# EAGLE design 32 zif to omnetics (EAGLE 7.2.0)
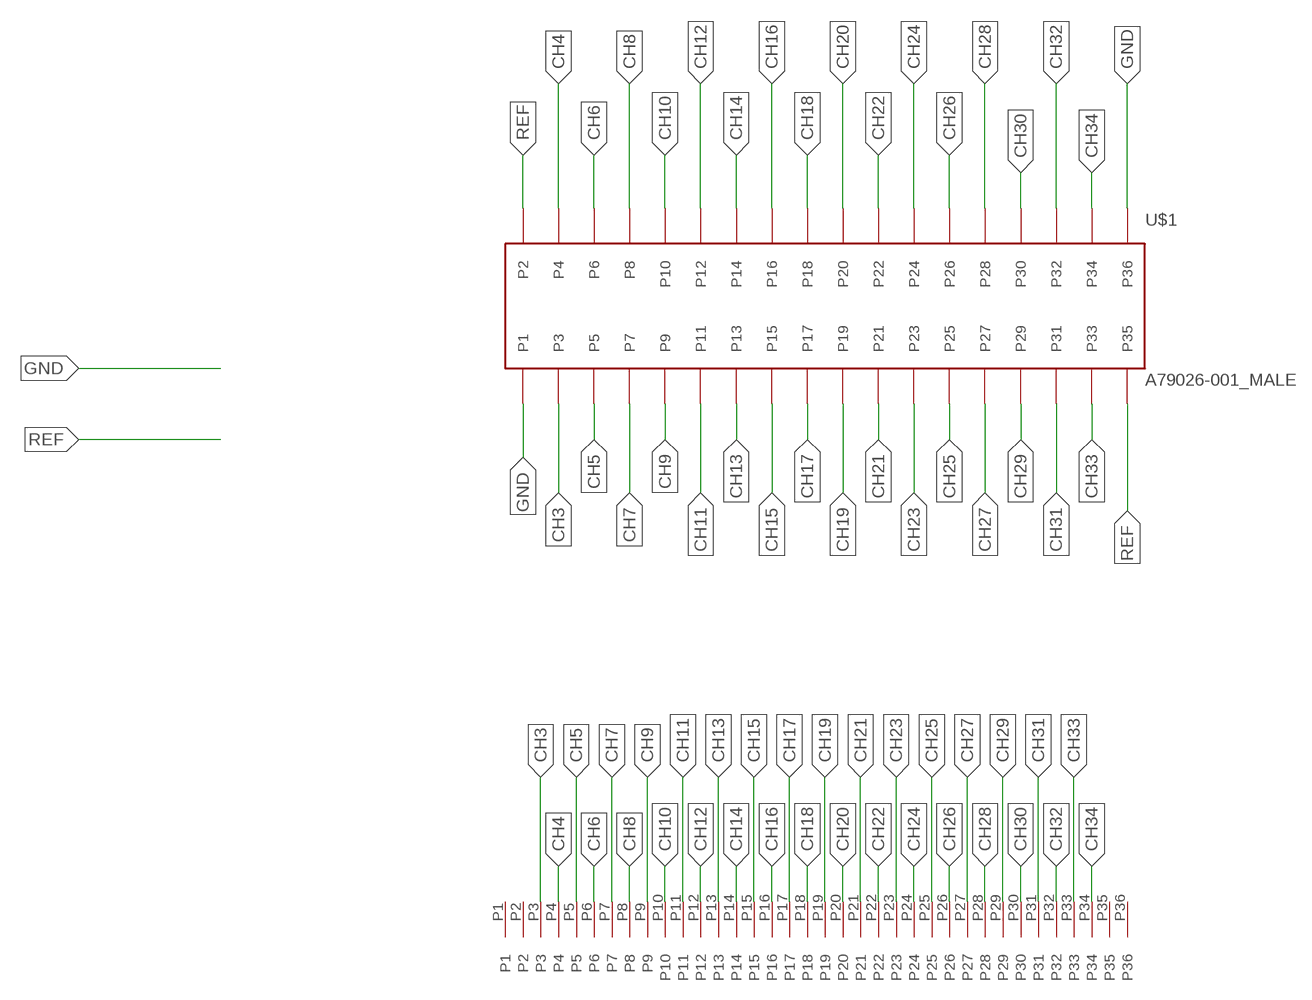
[diagram p0: schematic, sheet 1]

## Parts
U$1  A79026-001_MALE  [A79026-001_MALE]
U$2  ZIF_CONNECTOR_36  [ZIF_CONNECTOR_36]

## Nets
CH3: U$1.P3 U$2.P3
CH4: U$1.P4 U$2.P4
CH5: U$1.P5 U$2.P5
CH6: U$1.P6 U$2.P6
CH7: U$1.P7 U$2.P7
CH8: U$1.P8 U$2.P8
CH9: U$1.P9 U$2.P9
CH10: U$1.P10 U$2.P10
CH11: U$1.P11 U$2.P11
CH12: U$1.P12 U$2.P12
CH13: U$1.P13 U$2.P13
CH14: U$1.P14 U$2.P14
CH15: U$1.P15 U$2.P15
CH16: U$1.P16 U$2.P16
CH17: U$1.P17 U$2.P17
CH18: U$1.P18 U$2.P18
CH19: U$1.P19 U$2.P19
CH20: U$1.P20 U$2.P20
CH21: U$1.P21 U$2.P21
CH22: U$1.P22 U$2.P22
CH23: U$1.P23 U$2.P23
CH24: U$1.P24 U$2.P24
CH25: U$1.P25 U$2.P25
CH26: U$1.P26 U$2.P26
CH27: U$1.P27 U$2.P27
CH28: U$1.P28 U$2.P28
CH29: U$1.P29 U$2.P29
CH30: U$1.P30 U$2.P30
CH31: U$1.P31 U$2.P31
CH32: U$1.P32 U$2.P32
CH33: U$1.P33 U$2.P33
CH34: U$1.P34 U$2.P34
GND: U$1.P1 U$1.P36
REF: U$1.P2 U$1.P35
Unconnected: U$2.P1 U$2.P2 U$2.P35 U$2.P36

## Library data of the parts
U$1 = omnetics:A79026-001_MALE
U$2 = mayo_parts:ZIF_CONNECTOR_36

## Board
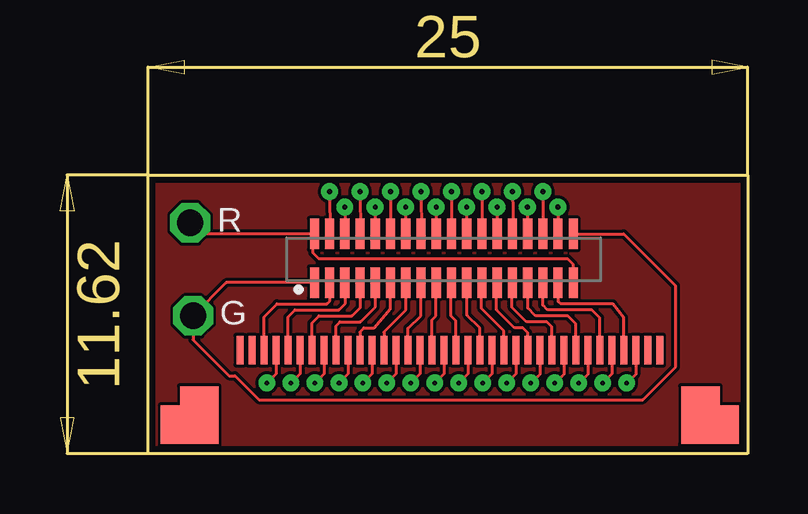
[diagram p1: board, top side]
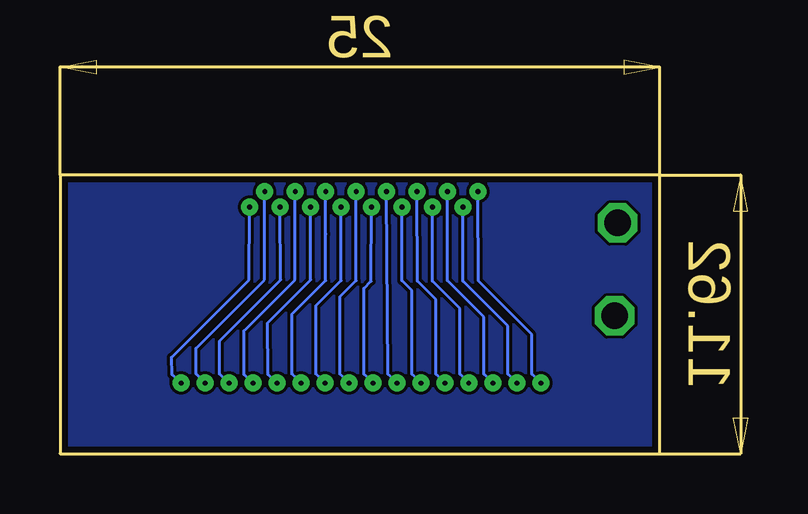
[diagram p2: board, bottom side, seen from below]

Size 25 x 11.62 mm. Coordinates in mm from the lower left corner, seen from the top.
Outline: 0,0 0,11.62 25,11.62 25,0 0,0
Copper layers (1*16): Top 0.035mm / dielectric 1.5mm / Bottom 0.035mm
Design rules "pcbtrain *": minimum track width 0.125mm, minimum drill 0.2mm, track to track 0.125mm, track to pad 0.125mm, pad to pad 0.125mm, via to via 0.125mm, smd to smd 0mil, copper to edge 10mil, drill to drill 0.2mm, minimum pad ring 10mil, minimum via ring 10mil, stop-mask expansion 0.125mm, vias tented up to drill 0mil, thermal gap 10mil

### Footprints (pad centres in the part's own frame; a part is rotated, then mirrored left to right if it is on the bottom)
A79026-001_MALE = smd 0.381 x 1.27: P1 -5.397,-1.016; P2 -5.397,1.016; P3 -4.763,-1.016; P4 -4.763,1.016; P5 -4.128,-1.016; P6 -4.128,1.016; P7 -3.493,-1.016; P8 -3.493,1.016; P9 -2.857,-1.016; P10 -2.857,1.016; P11 -2.223,-1.016; P12 -2.223,1.016; P13 -1.587,-1.016; P14 -1.587,1.016; P15 -0.953,-1.016; P16 -0.953,1.016; P17 -0.318,-1.016; P18 -0.318,1.016; P19 0.318,-1.016; P20 0.318,1.016; P21 0.953,-1.016; P22 0.953,1.016; P23 1.587,-1.016; P24 1.587,1.016; P25 2.223,-1.016; P26 2.223,1.016; P27 2.857,-1.016; P28 2.857,1.016; P29 3.493,-1.016; P30 3.493,1.016; P31 4.128,-1.016; P32 4.128,1.016; P33 4.763,-1.016; P34 4.763,1.016; P35 5.397,-1.016; P36 5.397,1.016
ZIF_CONNECTOR_36 = smd 0.3 x 1.2: P1 -8.5,0; P2 -8,0; P3 -7.5,0; P4 -7,0; P5 -6.5,0; P6 -6,0; P7 -5.5,0; P8 -5,0; P9 -4.5,0; P10 -4,0; P11 -3.5,0; P12 -3,0; P13 -2.5,0; P14 -2,0; P15 -1.5,0; P16 -1,0; P17 -0.5,0; P18 0,0; P19 0.5,0; P20 1,0; P21 1.5,0; P22 2,0; P23 2.5,0; P24 3,0; P25 3.5,0; P26 4,0; P27 4.5,0; P28 5,0; P29 5.5,0; P30 6,0; P31 6.5,0; P32 7,0; P33 7.5,0; P34 8,0; P35 8.5,0; P36 9,0; P$2 0.5,0; P$3 1,0; P$4 1.5,0; P$8 3.5,0; P$10 4.5,0; P$17 -1,0; P$18 -0.5,0; P$19 -2,0; P$20 -1.5,0; P$21 -2.5,0; P$22 -3,0; P$23 -3.5,0; P$24 -4,0; P$25 -4.5,0; P$26 -5,0; P$27 -5.5,0; P$28 -6,0; P$29 -6.5,0; P$30 -7,0; P$31 -7.5,0; P$34 8.5,0; P$36 -8.5,0; P$41 0,0; P$42 0.5,0; P$43 1,0; P$44 1.5,0; P$45 2,0; P$46 2.5,0; P$47 3,0; P$48 3.5,0; P$49 4,0; P$50 4.5,0; P$51 5,0; P$52 5.5,0; P$53 6,0; P$54 6.5,0; P$55 7,0; P$56 7.5,0; P$57 -1,0; P$58 -0.5,0; P$59 -2,0; P$60 -1.5,0; P$61 -2.5,0; P$62 -3,0; P$63 -3.5,0; P$64 -4,0; P$65 -4.5,0; P$66 -5,0; P$67 -5.5,0; P$68 -6,0; P$69 -6.5,0; P$70 -7,0; P$71 -7.5,0; P$72 8,0; P$73 -8,0; P$74 8.5,0; P$75 9,0; P$76 -8.5,0; P$81 0,0; P$85 2,0; P$86 2.5,0; P$87 3,0; P$89 4,0; P$91 5,0; P$92 5.5,0; P$93 6,0; P$94 6.5,0; P$95 7,0; P$96 7.5,0; P$112 8,0; P$113 -8,0; P$115 9,0 | smd 1.6 x 2.4: P$37 10.7,-2.7; P$38 -10.2,-2.7; P$77 10.7,-2.7; P$78 -10.2,-2.7; P$117 10.7,-2.7; P$118 -10.2,-2.7 | smd 0.8 x 1.6: P$39 -11.4,-3.1; P$40 11.9,-3.1; P$79 -11.4,-3.1; P$80 11.9,-3.1; P$119 -11.4,-3.1; P$120 11.9,-3.1

### Placement (x,y rotation side)
U$1  12.33,8.15 0 top
U$2  12.33,4.32 0 top

### Tracks (layer width: path | path; a pad name or v marks a point on that pad's centre or on a via)
CH3
  Top 0.125: U$2.P3 4.83,5.7 5.38,6.25 7.45,6.25 7.58,6.38 U$1.P3
CH4  (via drill 0.2)
  Top 0.125: U$2.P4 5.33,3.33 v4.95,2.95 | v7.57,10.93 U$1.P4
  Bottom 0.125: v4.95,2.95 5.32,3.32 5.32,4.98 7.55,7.2 7.58,10.81 v7.57,10.93
CH5
  Top 0.125: U$2.P5 5.83,5.7 6.12,6 7.95,6 8.23,6.27 8.23,7.11 U$1.P5
CH6  (via drill 0.2)
  Top 0.125: U$2.P6 6.33,3.33 v5.95,2.95 | v8.2,10.3 U$1.P6
  Bottom 0.125: v5.95,2.95 6.32,3.32 6.32,5.32 8.2,7.2 v8.2,10.3
CH7
  Top 0.125: U$2.P7 6.83,5.45 7.12,5.75 8.5,5.75 8.85,6.1 U$1.P7
CH8  (via drill 0.2)
  Top 0.125: U$2.P8 7.33,3.33 v6.95,2.95 | v8.84,10.93 U$1.P8
  Bottom 0.125: v6.95,2.95 7.32,3.32 7.32,5.7 8.85,7.23 v8.84,10.93
CH9
  Top 0.125: U$2.P9 7.83,5.33 8,5.5 8.85,5.5 9.48,6.12 U$1.P9
CH10  (via drill 0.2)
  Top 0.125: U$2.P10 8.33,3.33 v7.95,2.95 | v9.47,10.3 U$1.P10
  Bottom 0.125: v7.95,2.95 8.33,3.32 8.33,6.05 9.48,7.2 v9.47,10.3
CH11
  Top 0.125: U$1.P11 10.1,6.05 9.42,5.25 9,5.25 8.83,5.08 U$2.P11 8.83,4.34
CH12  (via drill 0.2)
  Top 0.125: U$2.P12 9.33,3.33 v8.95,2.95 | v10.11,10.93 U$1.P12
  Bottom 0.125: v8.95,2.95 9.33,3.32 9.33,6.43 10.1,7.2 v10.11,10.93
CH13
  Top 0.125: U$1.P13 10.75,6 9.83,5.08 U$2.P13
CH14  (via drill 0.2)
  Top 0.125: U$2.P14 10.33,3.33 v9.95,2.95 | v10.74,10.3 10.72,9.18 U$1.P14
  Bottom 0.125: v9.95,2.95 10.33,3.32 10.33,6.8 10.75,7.23 10.74,10.26 v10.74,10.3
CH15
  Top 0.125: U$2.P15 10.83,5.23 11.38,5.75 U$1.P15
CH16  (via drill 0.2)
  Top 0.125: U$2.P16 11.33,3.33 v10.95,2.95 | v11.38,10.93 11.4,9.19 U$1.P16
  Bottom 0.125: v10.95,2.95 11.33,3.32 11.38,10.82 v11.38,10.93
CH17
  Top 0.125: U$2.P17 11.83,5.58 12,5.75 U$1.P17
CH18  (via drill 0.2)
  Top 0.125: U$2.P18 12.33,3.33 v11.95,2.95 | v12.01,10.3 12.02,9.18 U$1.P18
  Bottom 0.125: v11.95,2.95 12.33,3.32 12.33,6.9 12.02,7.2 v12.01,10.3
CH19
  Top 0.125: U$2.P19 12.83,5.55 12.62,5.75 12.62,7.11 U$1.P19
CH20  (via drill 0.2)
  Top 0.125: U$2.P20 13.33,3.33 v12.95,2.95 | v12.65,10.93 U$1.P20
  Bottom 0.125: v12.95,2.95 13.33,3.32 13.33,6.55 12.65,7.23 v12.65,10.93
CH21
  Top 0.125: U$2.P21 13.83,5.25 13.3,5.77 13.3,7.12 U$1.P21
CH22  (via drill 0.2)
  Top 0.125: U$2.P22 14.33,3.33 v13.95,2.95 | v13.28,10.3 U$1.P22
  Bottom 0.125: v13.95,2.95 14.33,3.32 14.33,6.18 13.27,7.23 v13.28,10.3
CH23
  Top 0.125: U$2.P23 14.83,5.12 13.9,6.05 13.9,7.12 U$1.P23
CH24  (via drill 0.2)
  Top 0.125: U$2.P24 15.33,3.33 v14.95,2.95 | v13.92,10.93 U$1.P24
  Bottom 0.125: v14.95,2.95 15.33,3.33 15.33,5.82 13.92,7.23 13.92,9.16 U$1.P24 13.92,10.94 v13.92,10.93
CH25
  Top 0.125: U$2.P25 15.83,5.05 15.62,5.25 15.27,5.25 14.52,6 14.52,7.11 U$1.P25
CH26  (via drill 0.2)
  Top 0.125: U$2.P26 16.33,3.3 v15.95,2.95 | v14.55,10.3 U$1.P26
  Bottom 0.125: v15.95,2.95 16.33,3.3 16.35,5.45 14.55,7.25 v14.55,10.3
CH27
  Top 0.125: U$2.P27 16.83,5.3 16.62,5.5 15.77,5.5 15.17,6.1 15.17,7.12 U$1.P27
CH28  (via drill 0.2)
  Top 0.125: U$2.P28 17.33,3.3 v16.95,2.95 | v15.19,10.93 15.23,9.2 U$1.P28
  Bottom 0.125: v16.95,2.95 17.33,3.3 17.33,5.12 15.2,7.25 15.19,10.86 v15.19,10.93
CH29
  Top 0.125: U$2.P29 17.83,5.42 17.5,5.75 16.15,5.75 15.83,6.07 U$1.P29
CH30  (via drill 0.2)
  Top 0.125: U$2.P30 18.33,3.3 v17.95,2.95 | v15.82,10.3 15.8,9.19 U$1.P30
  Bottom 0.125: v17.95,2.95 18.35,3.32 18.35,4.7 15.8,7.25 v15.82,10.3
CH31
  Top 0.125: U$2.P31 18.83,5.67 18.5,6 16.65,6 16.45,6.2 U$1.P31
CH32  (via drill 0.2)
  Top 0.125: U$2.P32 19.33,3.33 v18.95,2.95 | v16.46,10.93 U$1.P32
  Bottom 0.125: v18.95,2.95 19.33,3.32 19.33,4.4 16.48,7.25 16.46,10.91 v16.46,10.93
CH33
  Top 0.125: U$2.P33 19.83,5.67 19.38,6.25 17.2,6.25 17.1,6.35 U$1.P33
CH34  (via drill 0.2)
  Top 0.125: U$2.P34 20.33,3.3 v19.95,2.95 | v17.09,10.3 U$1.P34
  Bottom 0.125: v19.95,2.95 20.33,3.3 20.35,4.02 17.12,7.25 17.09,10.24 v17.09,10.3
GND  (via drill 1.1)
  Top 0.125: U$1.P1 3.26,7.13 v1.88,5.75 1.88,4.75 3.38,3.25 3.62,3.25 4.62,2.25 20.62,2.25 22,3.62 22,7 19.83,9.17 U$1.P36
N$1
  pour Top: 0,11.62 25,11.62 25,0 0,0
N$2
  pour Bottom: 0,11.62 25,11.62 25,0 0,0
REF  (via drill 1.1)
  Top 0.125: v1.75,9.62 2.21,9.17 U$1.P2 6.88,9.11 6.88,8.38 7.12,8.12 17.5,8.12 17.73,7.9 U$1.P35

### Text on the board
tNames: R | G